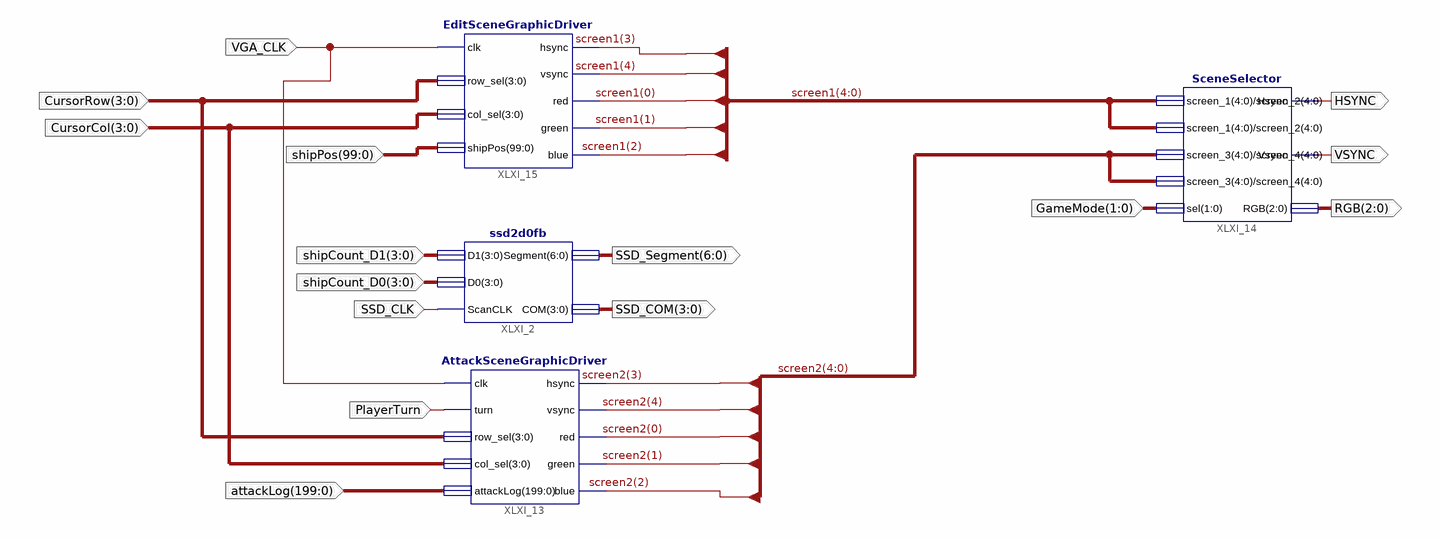
[diagram p0: schematic sheet 1]
// Xilinx ISE schematic DisplayUnit.sch (spartan6) as structural Verilog: 4 symbols, 15 ports
module DisplayUnit (
  input  VGA_CLK,
  input  [3:0] CursorRow,
  input  [3:0] CursorCol,
  input  [99:0] shipPos,
  input  [3:0] shipCount_D1,
  input  [3:0] shipCount_D0,
  input  SSD_CLK,
  input  [199:0] attackLog,
  input  [1:0] GameMode,
  input  PlayerTurn,
  output [6:0] SSD_Segment,
  output [3:0] SSD_COM,
  output HSYNC,
  output VSYNC,
  output [2:0] RGB
);

  wire [4:0] screen1, screen2;

  ssd2d0fb XLXI_2 (.D1(shipCount_D1), .D0(shipCount_D0), .ScanCLK(SSD_CLK), .Segment(SSD_Segment), .COM(SSD_COM));
  AttackSceneGraphicDriver XLXI_13 (
    .clk(VGA_CLK), .turn(PlayerTurn), .row_sel(CursorRow), .col_sel(CursorCol), .attackLog(attackLog),
    .hsync(screen2[3]), .vsync(screen2[4]), .red(screen2[0]), .green(screen2[1]), .blue(screen2[2]));
  SceneSelector XLXI_14 (
    .screen_1(screen1), .screen_2(screen1), .screen_3(screen2), .screen_4(screen2), .sel(GameMode),
    .Hsync(HSYNC), .Vsync(VSYNC), .RGB(RGB));
  EditSceneGraphicDriver XLXI_15 (
    .clk(VGA_CLK), .row_sel(CursorRow), .col_sel(CursorCol), .shipPos(shipPos), .hsync(screen1[3]),
    .vsync(screen1[4]), .red(screen1[0]), .green(screen1[1]), .blue(screen1[2]));
endmodule
